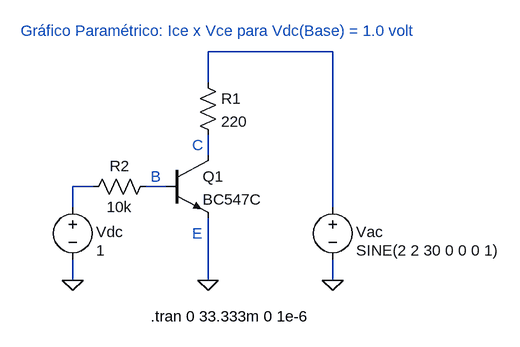
[diagram p0: schematic XY_npn_BC547C.asc]
XY_npn_BC547C.asc, the LTspice schematic file:
Version 4
SHEET 1 1032 680
WIRE 304 -160 112 -160
WIRE 112 -112 112 -160
WIRE 112 0 112 -32
WIRE -64 48 -96 48
WIRE 48 48 16 48
WIRE -96 80 -96 48
WIRE 304 80 304 -160
WIRE -96 192 -96 160
WIRE 112 192 112 96
WIRE 304 192 304 160
FLAG -96 192 0
FLAG 112 192 0
FLAG 304 192 0
SYMBOL voltage -96 64 R0
WINDOW 0 36 54 Left 2
WINDOW 123 0 0 Left 2
WINDOW 39 36 82 Left 2
WINDOW 3 36 82 Left 2
SYMATTR InstName Vdc
SYMATTR Value 1
SYMBOL res 96 -128 R0
SYMATTR InstName R1
SYMATTR Value 220
SYMBOL voltage 304 64 R0
WINDOW 0 36 54 Left 2
WINDOW 123 0 0 Left 2
WINDOW 39 36 82 Left 2
WINDOW 3 36 82 Left 2
SYMATTR InstName Vac
SYMATTR Value SINE(2 2 30 0 0 0 1)
SYMBOL res -80 64 R270
WINDOW 0 32 56 VTop 2
WINDOW 3 0 56 VBottom 2
SYMATTR InstName R2
SYMATTR Value 10k
SYMBOL npn 48 0 R0
SYMATTR InstName Q1
SYMATTR Value BC547C
TEXT 24 248 Left 2 !.tran 0 33.333m 0 1e-6
TEXT -176 -192 Left 2 ;Gráfico Paramétrico: Ice x Vce para Vdc(Base) = 1.0 volt
TEXT 88 -16 Left 2 ;C
TEXT 24 32 Left 2 ;B
TEXT 88 120 Left 2 ;E

The netlist it stands for:
* XY_npn_BC547C.asc
Vdc N003 0 1
R1 N001 N002 220
Vac N001 0 SINE(2 2 30 0 0 0 1)
R2 N003 N004 10k
Q1 N002 N004 0 0 BC547C
.model NPN NPN
.model PNP PNP
.lib standard.bjt
.tran 0 33.333m 0 1e-6
* Gráfico Paramétrico: Ice x Vce para Vdc(Base) = 1.0 volt
* C
* B
* E
.backanno
.end